# Altium project OR_TM2Space.PrjPcb
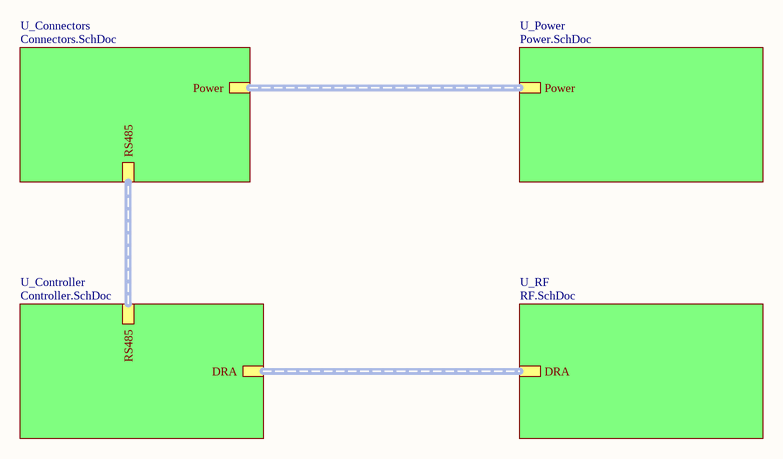
[diagram p0: Legend.SchDoc]
PCBSolderMaskSides: Both Sides; PCBSolderMaskColor: Green; PCBSilkscreenSides: Both Sides; PCBSilkscreenColor: White; PCBMfgStandard: IPC 6012 Class 2; PCBFinishThickness: 63 mils +/- 10%; PCBFinishPlating: LEAD FREE HASL; GlobalRevisionDate: 09/11/2022; GlobalProjectRevision: REV1-0; GlobalProjectName: OR_TM2Space; GlobalProjectCustomer: OR_TM2Space; DONOTPOPULATE: DNP
5 sheets, 103 parts. Net scope: hierarchical (ports join the sheet entries above them; power ports are global).
Board file: OR_TM2Space.PcbDoc
Sheets:
  Legend.SchDoc
    U_Connectors = Connectors.SchDoc
    U_Controller = Controller.SchDoc
    U_Power = Power.SchDoc
    U_RF = RF.SchDoc

## Sheet Legend.SchDoc
size A4; SheetNumber: 1; SheetTotal: 5

### Sub-sheets
U_Connectors = Connectors.SchDoc: RS485, Power
U_Controller = Controller.SchDoc: RS485, DRA
U_Power = Power.SchDoc: Power
U_RF = RF.SchDoc: DRA

### Buses and harness runs
harness sheet U_Connectors/Power = sheet U_Power/Power
harness sheet U_Connectors/RS485 = sheet U_Controller/RS485
harness sheet U_Controller/DRA = sheet U_RF/DRA

## Sheet Connectors.SchDoc
size A4; SheetNumber: 2; SheetTotal: 5
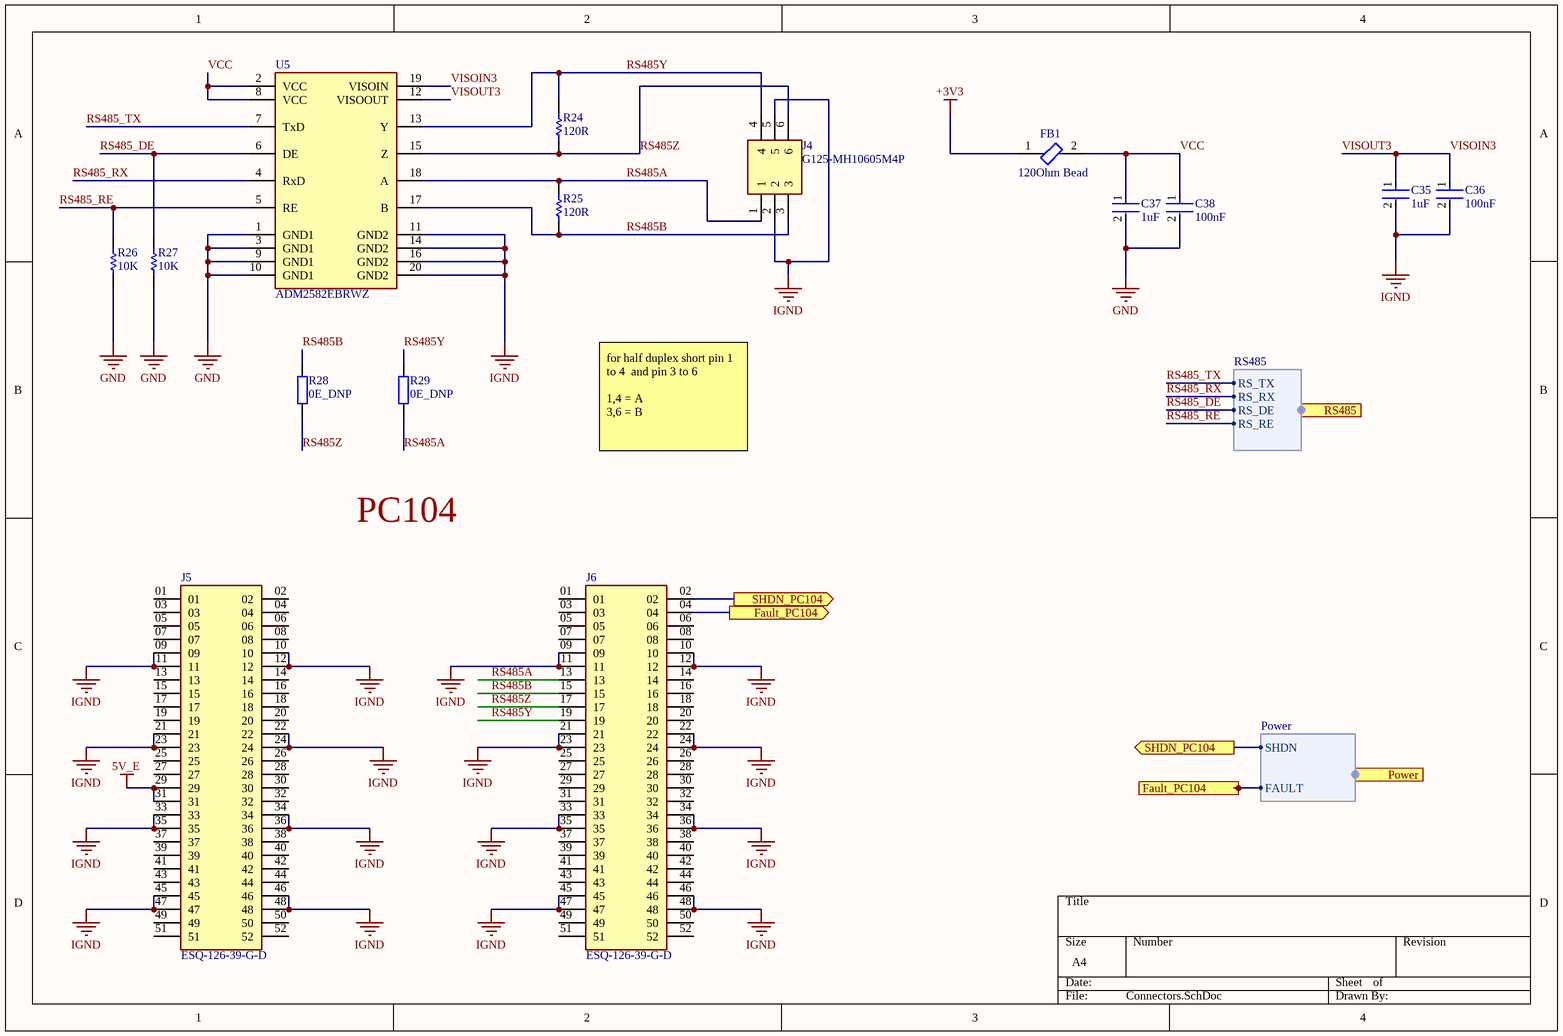
[diagram p1: Connectors.SchDoc]

### Parts
C35  1uF  [CAP0603S]
C36  100nF  [CAP0402S]
C37  1uF  [CAP0603S]
C38  100nF  [CAP0402S]
FB1  120Ohm Bead  [FB0402S]
J4  G125-MH10605M4P  [HARWIN_G125-MH10605M4P]
J5  ESQ-126-39-G-D  [SAMTEC_ESQ-126-39-G-D]
J6  ESQ-126-39-G-D  [SAMTEC_ESQ-126-39-G-D]
R24  120R  [RES0805S]
R25  120R  [RES0805S]
R26  10K  [RES0402S]
R27  10K  [RES0402S]
R28  0E_DNP  [RES0603S]
R29  0E_DNP  [RES0603S]
U5  ADM2582EBRWZ  [SOIC-20]

### Ports
Fault_PC104 (out), Power (harness Power), RS485 (harness RS485), SHDN_PC104 (out)

### Harnesses
RS485: RS_TX, RS_RX, RS_DE, RS_RE
Power: SHDN, FAULT

### Nets
5V_E: J5.29 J5.31
+3V3: FB1.1
GND: C37.2 C38.2 R26.1 R27.1 U5.1(GND1) U5.3(GND1) U5.9(GND1) U5.10(GND1)  [project net VSSA]
IGND: C35.2 C36.2 J4.2 J4.5 J5.09 J5.10 J5.11 J5.12 J5.21 J5.22 J5.23 J5.24 J5.33 J5.34 J5.35 J5.36 J5.45 J5.46 J5.47 J5.48 J6.09 J6.10 J6.11 J6.12 J6.21 J6.22 J6.23 J6.24 J6.33 J6.34 J6.35 J6.36 J6.45 J6.46 J6.47 J6.48 U5.11(GND2) U5.14(GND2) U5.16(GND2) U5.20(GND2)
Fuse_FLT: J6.04 ; port Fault_PC104, port Power.FAULT
Fuse_SNT: J6.02 ; port SHDN_PC104, port Power.SHDN
RS485_DE: R27.2 U5.6(DE) ; port RS485.RS_DE
RS485_RE: R26.2 U5.5(RE) ; port RS485.RS_RE
RS485_RX: U5.4(RxD) ; port RS485.RS_RX
RS485_TX: U5.7(TxD) ; port RS485.RS_TX
RS485A: J4.1 J6.13 R25.2 R29.1 U5.18(A)
RS485B: J4.3 J6.15 R25.1 R28.2 U5.17(B)
RS485Y: J4.4 J6.19 R24.2 R29.2 U5.13(Y)
RS485Z: J4.6 J6.17 R24.1 R28.1 U5.15(Z)
VCC: C37.1 C38.1 FB1.2 U5.2(VCC) U5.8(VCC)
VISOIN3: C35.1 C36.1 U5.12(VISOOUT) U5.19(VISOIN)  [also labelled VISOUT3]

Not connected (* = marked no-connect by the designer): J5 01 02 03 04 05 06 07 08 13 14 15 16 17 18 19 20 25 26 27 28 30 32 37 38 39 40 41 42 43 44 49 50 51 52; J6 01 03 05 06 07 08 14 16 18 20 25 26 27 28 29 30 31 32 37 38 39 40 41 42 43 44 49 50 51 52

### Notes on the sheet
- for half duplex short pin 1 to 4  and pin 3 to 6
  1,4 = A
  3,6 = B
- PC104

### Library data of the parts
C35 C37 = 11868f565c42a9108669ba33697ecf6: Ceramic Capacitor General Use 1uF ±10% 50V X7R 0603; Series: M; Width: 0.031inch; Mount: Surface Mount; Radiation Hardening: No; Voltage Rating (DC): 50V; Packaging: Tape and Reel; Termination: SMD/SMT; Depth: 0.8mm; Case Code (Metric): 1608; Case Code (Imperial): 0603; Height: 0.8mm; Voltage Rating: 50V; Package Quantity: 1; Halogen Free: Halogen Free; Dielectric: X7R; Min Operating Temperature: -55°C; Length: 1.6mm; Construction: Flat; Tolerance: 10%; Thickness: 0.037inch; Max Operating Temperature: 125°C; Case/Package: 0603; Capacitance: 1uF; RoHS Compliant: Yes
C36 C38 = b4654b650e69147ec39a6b967a45e02: CAP CER 0.1UF 10V X5R 0402; Manufacturer: Kemet; Manufacturer Part Number: C0402C104K8PACTU; Material: Ceramic; Capacitance: 0.10 μF; Temperature Coefficient: 15%; Tolerance: 0.1; Value: 0.10 μF; Package: C0402-BB; Temperature: -55°C to +125°C; ComponentLink2Description: Datasheet; Temperature Characteristic: X5R; Device Class L1: Passive Components; Height: 0.55mm; Lead Free: Yes; ComponentLink2URL: https://content.kemet.com/datasheets/KEM_C1002_X7R_SMD.pdf; Device Class L2: Capacitors; Temperature Range Low: -55°C; Temperature Range High: +125°C; RoHS: TRUE; Octopart: https://octopart.com/c0402c104k8pactu-kemet-140039; Automotive: No; Mouser Description: Capacitor 100 nF 10 VDC 0402; Category: Cap; Voltage Rating: 10 V; Digikey Description: CAP CER 0.1UF 10V X5R 0402; Ipc Land Pattern Name: CAPC10050X50; Device Class L3: Ceramic Capacitors
FB1 = 5f30dd21d616792df468990f7003faa: FERRITE BEAD 120 OHM 0805 1LN; Number of Lines: 1; DC Resistance-Max: 100mR; Material: Steel; Max DC Current: 200mA; Shielding: Unshielded; Test Frequency: 100MHz; Impedance: 120R; Current Rating: 800mA; Max Current Rating: 1A; Resistance: 150mR; Tolerance: 25%; Width: 1.25mm; Number of Circuits: 1; Military Standard: Not; Height: 0.85mm; Series: BLM21A; Min Operating Temperature: -55°C; DC Resistance (DCR): 100mR; Termination: SMD/SMT; Core Material: Ferrite; REACH SVHC: No SVHC; Radiation Hardening: No; Max Operating Temperature: 125°C; Number of Pins: 2; Case/Package: 0805; Case Code (Imperial): 0805; Frequency: 100MHz; Depth: 1.25mm; Length: 2mm; DC Current: 200mA; Lead Free: Lead Free; Case Code (Metric): 2012; Package Quantity: 1; Packaging: Tape and Reel
J4 = G125-MH10605M4P: Connector; Manufacturer_Name: Harwin; Datasheet Link: https://content.harwin.com/m/667f1be9427fb768/original/DRG-02921-Technical-Drawing-Datasheet-G125-MH1XX05M4P-pdf.pdf; Height: 5.25mm; Manufacturer_Part_Number: G125-MH10605M4P; Mouser Part Number: 855-G125MH1065M4PM4P; Mouser Price/Stock: https://www.mouser.co.uk/ProductDetail/Harwin/G125-MH10605M4P?qs=vHuUswq2%252BswF07IXFR1W6A%3D%3D
J5 J6 = ESQ-126-39-G-D: 52 Position Elevated Socket Connector Through Hole; MF: Samtec; Package: None; MP: ESQ-126-39-G-D; Value: *; Availability: Unavailable; Price: None; SnapEDA_Link: https://www.snapeda.com/parts/ESQ-126-39-G-D/Samtec%20Inc./view-part/490181/?ref=snap
R24 R25 = RES-2: Chip Resistor, 120 Ohm, +/- 1%, 0.125 W, -55 to 155 degC, 0805 (2012 Metric), RoHS, Tape and Reel; Manufacturer: Panasonic; Voltage Rating: 150 V; Mount: Surface Mount; ComponentLink1Description: Manufacturer URL; ComponentLink1URL: http://www.panasonic.com/; RoHSCompliant: true; Min Operating Temperature: -55 degC; Length: 2 mm; Max Operating Temperature: 155 degC; Packaging: Tape and Reel; Package Quantity: 5000; REACH SVHC: Yes; Pins: 2; ComponentLink2Description: Datasheet; DatasheetVersion: 04/2015; PackageReference: 0805; ComponentLink2URL: http://industrial.panasonic.com/cdbs/www-data/pdf/RDA0000/AOA0000C86.pdf; Mounting Technology: Surface Mount; PackageDescription: 2-Pin Surface Mount Device, Body 2 x 1.25 mm; Height: 0.6 mm
R26 R27 = RES-2: Chip Resistor, 10 KOhm, +/- 1%, 0.1 W, -55 to 155 degC, 0402 (1005 Metric), RoHS, Tape and Reel; Manufacturer: Panasonic; Power Rating: 100mW; Voltage Rating: 50V; Resistance: 10KOhm; Case\/Package: 0402; Temperature Coefficient: 100ppm\/degreesC; RoHSCompliant: True; Lead Free: LeadFree; Package Quantity: 1; Contact Plating: Tin; Length: 1mm; Radiation Hardening: No; REACH SVHC: NoSVHC; Max Operating Temperature: 155degC; Depth: 0.5mm; Case Code (Imperial): 0402; Military Standard: Not; Package Description: 2-Pin Surface Mount Device, Body 1 x 0.5 mm; Termination: SMD/SMT; Case Code (Metric): 1005; Height: 0.35mm; Packaging: TapeandReel; Voltage Rating (DC): 50V; Package Reference: 402; Number of Pins: 2; Tolerance: 1%; Mounting Technology: SurfaceMount; Width: 0.02inch; Mount: SurfaceMount; Datasheet URL: https://industrial.panasonic.com/cdbs/www-data/pdf/RDA0000/AOA0000C304.pdf; Composition: ThickFilm; Datasheet Version: 02/2017; Manufacturer URL: http://www.panasonic.com/; Max Power Dissipation: 100mW; Number of Terminations: 2; Min Operating Temperature: -55degC
R28 R29 = RES_0603: Resistor SMD 0603; Manufacturer: *; Manufacturer Part Number: *; Distributor Link: *; LCSC: *
U5 = ADM2582EBRWZ: Isolated Full Duplex RS485 Transreciver

## Sheet Controller.SchDoc
size A4; SheetNumber: 3; SheetTotal: 5
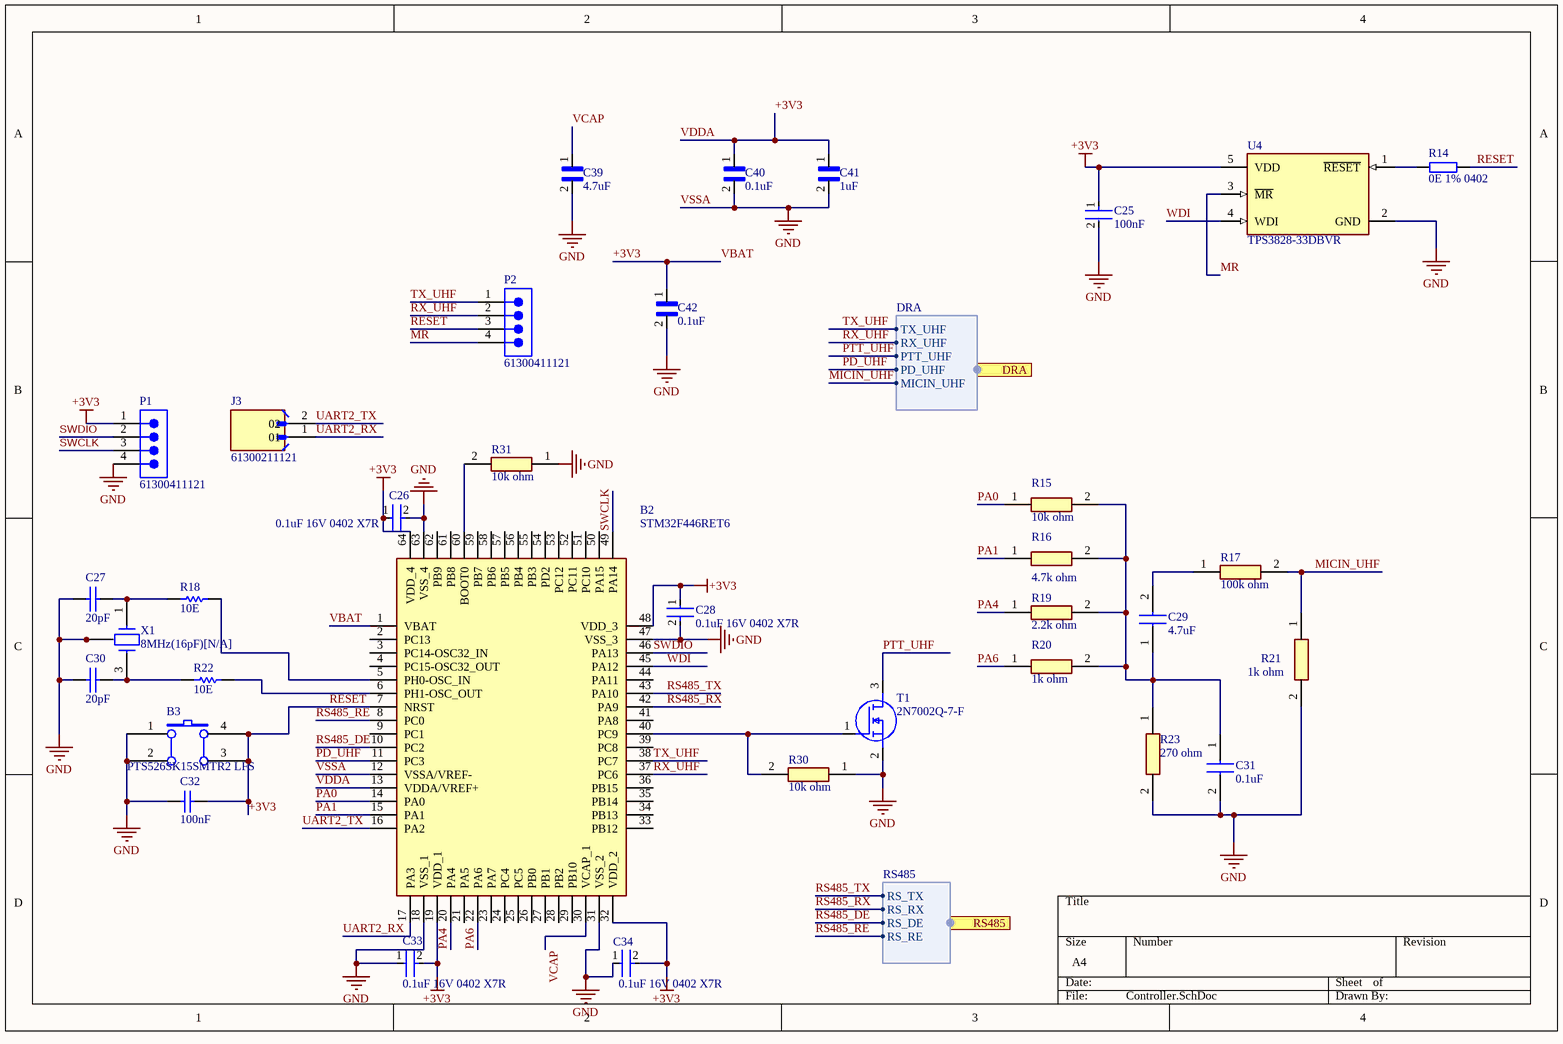
[diagram p2: Controller.SchDoc]

### Parts
B2  STM32F446RET6  [LQFP64]
B3  PTS526SK15SMTR2 LFS  [PTS526SK15SMTR2 LFS]
C25  100nF  [CAP0402S]
C26  0.1uF 16V 0402 X7R  [CAP0402S]
C27  20pF  [C0201]
C28  0.1uF 16V 0402 X7R  [CAP0402S]
C29  4.7uF  [CAP0603S]
C30  20pF  [C0201]
C31  0.1uF  [CAP0603S]
C32  100nF  [CAP0603S]
C33  0.1uF 16V 0402 X7R  [CAP0402S]
C34  0.1uF 16V 0402 X7R  [CAP0402S]
C39  4.7uF  [CAP0603S]
C40  0.1uF  [CAP0603S]
C41  1uF  [CAP0603S]
C42  0.1uF  [CAP0603S]
J3  61300211121  [HDR_P2.54_2X1_VERTICAL_TH]
P1  61300411121  [HDR_P2.0_4X1_VERTICAL_TH]
P2  61300411121  [HDR_P2.0_4X1_VERTICAL_TH]
R14  0E 1% 0402  [RES0402S]
R15  10k ohm  [RES0603S]
R16  4.7k ohm  [RES0603S]
R17  100k ohm  [RES0603S]
R18  10E  [RES0603S]
R19  2.2k ohm  [RES0603S]
R20  1k ohm  [RES0603S]
R21  1k ohm  [RES0603S]
R22  10E  [RES0603S]
R23  270 ohm  [RES0603S]
R30  10k ohm  [RES0603S]
R31  10k ohm  [RES0603S]
T1  2N7002Q-7-F  [SOT23_3]
U4  TPS3828-33DBVR  [SOT23-5]
X1  8MHz(16pF)[N/A]  [WE-XTAL_CFPX-104]

### Ports
DRA (harness DRA), RS485 (harness RS485)

### Harnesses
RS485: RS_TX, RS_RX, RS_DE, RS_RE
DRA: TX_UHF, RX_UHF, PTT_UHF, PD_UHF, MICIN_UHF

### Nets
+3V3: B2.1(VBAT) B2.7(NRST) B2.13(VDDA/VREF+) B2.19(VDD_1) B2.32(VDD_2) B2.48(VDD_3) B2.64(VDD_4) B3.3(B1) B3.4(A1) C25.1 C26.1 C28.1 C32.1 C33.2 C34.2 C40.1 C41.1 C42.1 P1.1 P2.3 R14.2 U4.5(VDD)  [also labelled RESET, VBAT, VDDA]
VSSA: B2.12(VSSA/VREF-) B2.18(VSS_1) B2.31(VSS_2) B2.47(VSS_3) B2.63(VSS_4) B3.1(A0) B3.2(B0) C25.2 C26.2 C27.2 C28.2 C30.2 C31.2 C32.2 C33.1 C34.1 C39.2 C40.2 C41.2 C42.2 P1.4 R21.2 R23.2 R30.1 R31.1 T1.2(S) U4.2(GND) X1.2 X1.4  [also labelled GND]
MICIN_UHF: R17.2 R21.1 ; port DRA.MICIN_UHF
MR: P2.4 U4.3(~{MR})
PA0: B2.14(PA0) R15.1
PA1: B2.15(PA1) R16.1
PA4: B2.20(PA4) R19.1
PA6: B2.22(PA6) R20.1
PD_UHF: B2.11(PC3) ; port DRA.PD_UHF
PTT_UHF: T1.3(D) ; port DRA.PTT_UHF
RS485_DE: B2.10(PC2) ; port RS485.RS_DE
RS485_RE: B2.8(PC0) ; port RS485.RS_RE
RS485_RX: B2.42(PA9) ; port RS485.RS_RX
RS485_TX: B2.43(PA10) ; port RS485.RS_TX
RX_UHF: B2.37(PC6) P2.2 ; port DRA.RX_UHF
SWCLK: B2.49(PA14) P1.3
SWDIO: B2.46(PA13) P1.2
TX_UHF: B2.38(PC7) P2.1 ; port DRA.TX_UHF
UART2_RX: B2.17(PA3) J3.1(01)
UART2_TX: B2.16(PA2) J3.2(02)
VCAP: B2.30(VCAP_1) C39.1
WDI: B2.45(PA12) U4.4(WDI)
NetB2_5: B2.5(PH0-OSC_IN) R18.1
NetB2_6: B2.6(PH1-OSC_OUT) R22.1
NetB2_40: B2.40(PC9) R30.2 T1.1(G)
NetB2_60: B2.60(BOOT0) R31.2
NetC27_1: C27.1 R18.2 X1.1
NetC29_1: C29.1 C31.1 R15.2 R16.2 R19.2 R20.2 R23.1
NetC29_2: C29.2 R17.1
NetC30_1: C30.1 R22.2 X1.3
NetR14_1: R14.1 U4.1(~{RESET})

Not connected (* = marked no-connect by the designer): B2 2(PC13) 3(PC14-OSC32_IN) 4(PC15-OSC32_OUT) 9(PC1) 21(PA5) 23(PA7) 24(PC4) 25(PC5) 26(PB0) 27(PB1) 28(PB2) 29(PB10) 33(PB12) 34(PB13) 35(PB14) 36(PB15) 39(PC8) 41(PA8) 44(PA11) 50(PA15) 51(PC10) 52(PC11) 53(PC12) 54(PD2) 55(PB3) 56(PB4) 57(PB5) 58(PB6) 59(PB7) 61(PB8) 62(PB9)

### Library data of the parts
B2 = STM32F446RET6: 32-Bit MCU+DSP 512K Flash 180MHz LQFP64 STMicroelectronics STM32F446RET6, 32bit ARM Cortex M4 MCU, 180MHz, 512 kB Flash, 64-Pin LQFP; Geometry.Height: 1.6mm; Mouser Part Number: 511-STM32F446RET6; Mouser Price/Stock: https://www.mouser.co.uk/ProductDetail/STMicroelectronics/STM32F446RET6?qs=Ok1pvOkw6%2FqpQsWf8F4wtQ%3D%3D; Manufacturer_Name: STMicroelectronics; Manufacturer_Part_Number: STM32F446RET6; Datasheet Link: https://datasheet.datasheetarchive.com/originals/distributors/DKDS41/DSANUWW0028583.pdf
B3 = SW PUSHBUTTON: SE PUSHBUTTON
C25 = b4654b650e69147ec39a6b967a45e02: as C36 on sheet Connectors; Package: C0402-BB; Temperature: -55°C to +125°C; ComponentLink2Description: Datasheet; Temperature Characteristic: X5R; Device Class L1: Passive Components; Height: 0.55mm; Lead Free: Yes; ComponentLink2URL: https://content.kemet.com/datasheets/KEM_C1002_X7R_SMD.pdf; Device Class L2: Capacitors; Temperature Range Low: -55°C; Temperature Range High: +125°C; RoHS: TRUE; Octopart: https://octopart.com/c0402c104k8pactu-kemet-140039; Automotive: No; Mouser Description: Capacitor 100 nF 10 VDC 0402; Category: Cap; Voltage Rating: 10 V; Digikey Description: CAP CER 0.1UF 10V X5R 0402; Ipc Land Pattern Name: CAPC10050X50; Device Class L3: Ceramic Capacitors
C26 C28 C33 C34 = 236180d848d6139a670b325ea6854c9: CAP CER 0.1UF 16V X7R 0402; Manufacturer Part Number: GRM155R71C104KA88D; Manufacturer: Murata; Standoff Height: 0mm; Tolerance: 10%; Voltage Rating: 16Vdc; Material: Ceramic; Capacitance: 0.10μF; Value: 0.10μF; RoHS: TRUE; Temperature Characteristic: X7R; Octopart: https://octopart.com/grm155r71c104ka88d-murata-196880; Digikey Description: CAP CER 0.1UF 16V X7R 0402; Device Class L3: Ceramic Capacitors; Height: 0.55mm; ComponentLink2Description: Datasheet; Temperature Range Low: -55°C; Ipc Land Pattern Name: CAPC10050X219; ComponentLink2URL: https://search.murata.co.jp/Ceramy/image/img/A01X/G101/ENG/GRM155R71H471KA01-01A.pdf; Device Class L1: Passive Components; Lead Free: yes; Category: Cap; Package: GRM15; Temperature: -55°C to +125°C; Device Class L2: Capacitors; Temperature Range High: +125°C; Mouser Description: 0402 0.1 uF 16V ±10 % Tolerance X7R SMT Multilayer Ceramic Capacitor
C27 C30 = CAP: Capacitor
C29 = GRM188R61E475KE11D: Capacitor; Manufacturer_Name: Murata Electronics; Datasheet Link: https://psearch.en.murata.com/capacitor/product/GRM188R61E475KE11%23.html; Height: 0.9mm; Manufacturer_Part_Number: GRM188R61E475KE11D; Mouser Part Number: 81-GRM188R61E475KE1D; Mouser Price/Stock: https://www.mouser.co.uk/ProductDetail/Murata-Electronics/GRM188R61E475KE11D?qs=eeBpzGFlv%252B9M0HqzMo%2FgYw%3D%3D; Arrow Part Number: GRM188R61E475KE11D; Arrow Price/Stock: https://www.arrow.com/en/products/grm188r61e475ke11d/murata-manufacturing?region=nac
C31 = C0603C104J5RACAUTO: Capacitor; Manufacturer_Name: KEMET; Datasheet Link: https://content.kemet.com/datasheets/KEM_C1023_X7R_AUTO_SMD.pdf; Height: 0.87mm; Manufacturer_Part_Number: C0603C104J5RACAUTO; Mouser Part Number: 80-C0603C104J5RAUTO; Mouser Price/Stock: https://www.mouser.co.uk/ProductDetail/KEMET/C0603C104J5RACAUTO?qs=XYJIsZbdjSO3ULwa1DwJaA%3D%3D; Arrow Part Number: C0603C104J5RACAUTO; Arrow Price/Stock: https://www.arrow.com/en/products/c0603c104j5racauto/kemet-corporation?region=europe
C32 = CAP: Capacitor; Value: 100pF; Published: 8-Jun-2000; Revision: July-2002: Re-released for DXP Platform.; Publisher: Altium Limited
C39-C42 = C0603C101J5GACTU: 100pF Â±5% 50V Ceramic Capacitor C0G, NP0 0603 _1608 Metric_; MF: KEMET; MP: C0603C101J5GACTU; SnapEDA_Link: https://www.snapeda.com/parts/C0603C101J5GACTU/KEMET/view-part/281849/?ref=snap; Availability: Unavailable; Package: 0603 Kemet; Value: *; Price: None
J3 = 61300211121: 2 pins, 1 row, straight, gold plating; MF: Wurth Electronics; SnapEDA_Link: https://www.snapeda.com/parts/61300211121/Wurth+Electronics/view-part/?ref=snap; Package: None; Value: *; MP: 61300211121; Check_prices: https://www.snapeda.com/parts/61300211121/Wurth+Electronics/view-part/?ref=eda
P1 P2 = CMP-1502-01064-3: NexarPartId: 32855522; Operating Supply Voltage: 250V; Pitch: 2.54mm; Contact Resistance: 20mΩ; Number of Positions: 4; Current Rating: 3A; Connector Type: Male Pin; Gender: Male; Contact Plating: Gold; Height: 8.89mm; Lead Pitch: 2.54mm; Lead Free: Lead Free; Contact Mating Length: 5.9944mm; Number of Rows: 1; Termination: Solder; Packaging: Bulk; REACH SVHC: Unknown; Min Operating Temperature: -40°C; RoHS: Compliant; Number of Contacts: 4; Voltage Rating: 250V; Color: Black; Max Operating Temperature: 105°C; Contact Material: Copper; Mount: Through Hole; Orientation: Vertical; Number of Pins: 4
R14 = RES_0402: Resistor SMD 0402; Manufacturer: *; Manufacturer Part Number: *; Distributor Link: *; LCSC: *
R15 R30 R31 = CRCW060310K0FKEA: Resistor; Manufacturer_Name: Vishay; Datasheet Link: http://www.vishay.com/docs/20035/dcrcwe3.pdf; Height: 0.5mm; Manufacturer_Part_Number: CRCW060310K0FKEA; Mouser Part Number: 71-CRCW0603-10K-E3; Mouser Price/Stock: https://www.mouser.co.uk/ProductDetail/Vishay-Dale/CRCW060310K0FKEA?qs=pAO1Z172M84BVnhDjtnsoQ%3D%3D; Arrow Part Number: CRCW060310K0FKEA; Arrow Price/Stock: https://www.arrow.com/en/products/crcw060310k0fkea/vishay?region=europe
R16 = CRCW06034K70FKEA: Resistor; Manufacturer_Name: Vishay; Datasheet Link: http://www.vishay.com/docs/20035/dcrcwe3.pdf; Height: 0.5mm; Manufacturer_Part_Number: CRCW06034K70FKEA; Mouser Part Number: 71-CRCW0603-4.7K-E3; Mouser Price/Stock: https://www.mouser.co.uk/ProductDetail/Vishay-Dale/CRCW06034K70FKEA?qs=4E3O%252BEEZcdLDG%2FSk4GmlWQ%3D%3D; Arrow Part Number: CRCW06034K70FKEA; Arrow Price/Stock: https://www.arrow.com/en/products/crcw06034k70fkea/vishay?region=nac
R17 = CRCW0603100KFKEA: Resistor; Manufacturer_Name: Vishay; Datasheet Link: http://www.vishay.com/docs/20035/dcrcwe3.pdf; Height: 0.5mm; Manufacturer_Part_Number: CRCW0603100KFKEA; Mouser Part Number: 71-CRCW0603-100K-E3; Mouser Price/Stock: https://www.mouser.co.uk/ProductDetail/Vishay-Dale/CRCW0603100KFKEA?qs=6dqgS%252BKntICWHMMdIzt5%2FQ%3D%3D; Arrow Part Number: CRCW0603100KFKEA; Arrow Price/Stock: https://www.arrow.com/en/products/crcw0603100kfkea/vishay?region=nac
R18 R22 = Res1: Resistor; Value: 1K; Published: 8-Jun-2000; Revision: July-2002: Re-released for DXP Platform.; Publisher: Altium Limited
R19 = CRCW06032K20JNEAHP: Resistor; Manufacturer_Name: Vishay; Datasheet Link: http://www.vishay.com/docs/20043/crcwhpe3.pdf; Height: 0.55mm; Manufacturer_Part_Number: CRCW06032K20JNEAHP; Mouser Part Number: 71-CRCW06032K20JNEAH; Mouser Price/Stock: https://www.mouser.co.uk/ProductDetail/Vishay-Dale/CRCW06032K20JNEAHP/?qs=k2%2FDWSARqgFWsVO90R5J%2FQ%3D%3D; Arrow Part Number: CRCW06032K20JNEAHP; Arrow Price/Stock: https://www.arrow.com/en/products/crcw06032k20jneahp/vishay
R20 R21 = CRCW06031K00FKEAHP: Resistor; Manufacturer_Name: Vishay; Datasheet Link: https://componentsearchengine.com/Datasheets/2/CRCW06031K00FKEAHP.pdf; Height: 0.55mm; Manufacturer_Part_Number: CRCW06031K00FKEAHP; Mouser Part Number: 71-CRCW06031K00FKEAH; Mouser Price/Stock: https://www.mouser.co.uk/ProductDetail/Vishay-Dale/CRCW06031K00FKEAHP?qs=FlFvgi4rxBx1%252B5DAse78lQ%3D%3D; Arrow Part Number: CRCW06031K00FKEAHP; Arrow Price/Stock: https://www.arrow.com/en/products/crcw06031k00fkeahp/vishay?region=nac
R23 = CRCW0603270RFKEA: Resistor; Manufacturer_Name: Vishay; Datasheet Link: http://www.vishay.com/docs/20035/dcrcwe3.pdf; Height: 0.5mm; Manufacturer_Part_Number: CRCW0603270RFKEA; Mouser Part Number: 71-CRCW0603-270-E3; Mouser Price/Stock: https://www.mouser.co.uk/ProductDetail/Vishay-Dale/CRCW0603270RFKEA?qs=pbofycSuseMg1CwiubILXA%3D%3D; Arrow Part Number: CRCW0603270RFKEA; Arrow Price/Stock: https://www.arrow.com/en/products/crcw0603270rfkea/vishay
T1 = 2N7000-G: MOSFET (N-Channel); Manufacturer_Name: Microchip; Datasheet Link: http://www.microchip.com/mymicrochip/filehandler.aspx?ddocname=en571380; Height: 5.334mm; Manufacturer_Part_Number: 2N7000-G; Mouser Part Number: 689-2N7000-G; Mouser Price/Stock: https://www.mouser.co.uk/ProductDetail/Microchip-Technology/2N7000-G?qs=yU2N9dt%252BrfnyR%2FOhNomgZw%3D%3D; Arrow Part Number: 2N7000-G; Arrow Price/Stock: https://www.arrow.com/en/products/2n7000-g/microchip-technology?region=nac
U4 = 340a9547a0ab8213f3a8fa70aee32e0: IC 2.93V SUPPLY MONITOR SOT23-5; Manufacturer Part Number: TPS3828-33DBVT; Manufacturer: Texas Instruments; Min Supply Voltage: 1.1V; Number Of Rails Monitored: 1; Max Supply Voltage: 5.5V; Reset Type: Active Low; Watchdog Timer: true; Nominal Supply Current: 15uA; Standoff Height: 0mm; Device Class L1: Integrated Circuits (ICs); Threshold Voltage: 2.93V; Ambient Temperature Range Low: -40°C; Temperature: -40°C to +85°C; Octopart: https://octopart.com/tps3828-33dbvt-texas+instruments-505920; Device Class L2: Power Management ICs; Lead Free: Yes; Height: 1.45mm; Mouser Description: Supervisory Circuits 2.93V Monitor; Automotive: No; ComponentLink2URL: http://www.ti.com/lit/ds/symlink/tps3828.pdf; Ambient Temperature Range High: +85°C; Digikey Description: IC 2.93V SUPPLY MONITOR SOT23-5; ComponentLink2Description: Datasheet; Category: IC; Package: DBV0005A; Temperature Range Low: -40°C; Device Class L3: Voltage Supervisors; Number Of Outputs: 1; RoHS: TRUE; Temperature Range High: +85°C
X1 = CRYSTAL

## Sheet Power.SchDoc
size A3; SheetNumber: 5; SheetTotal: 5
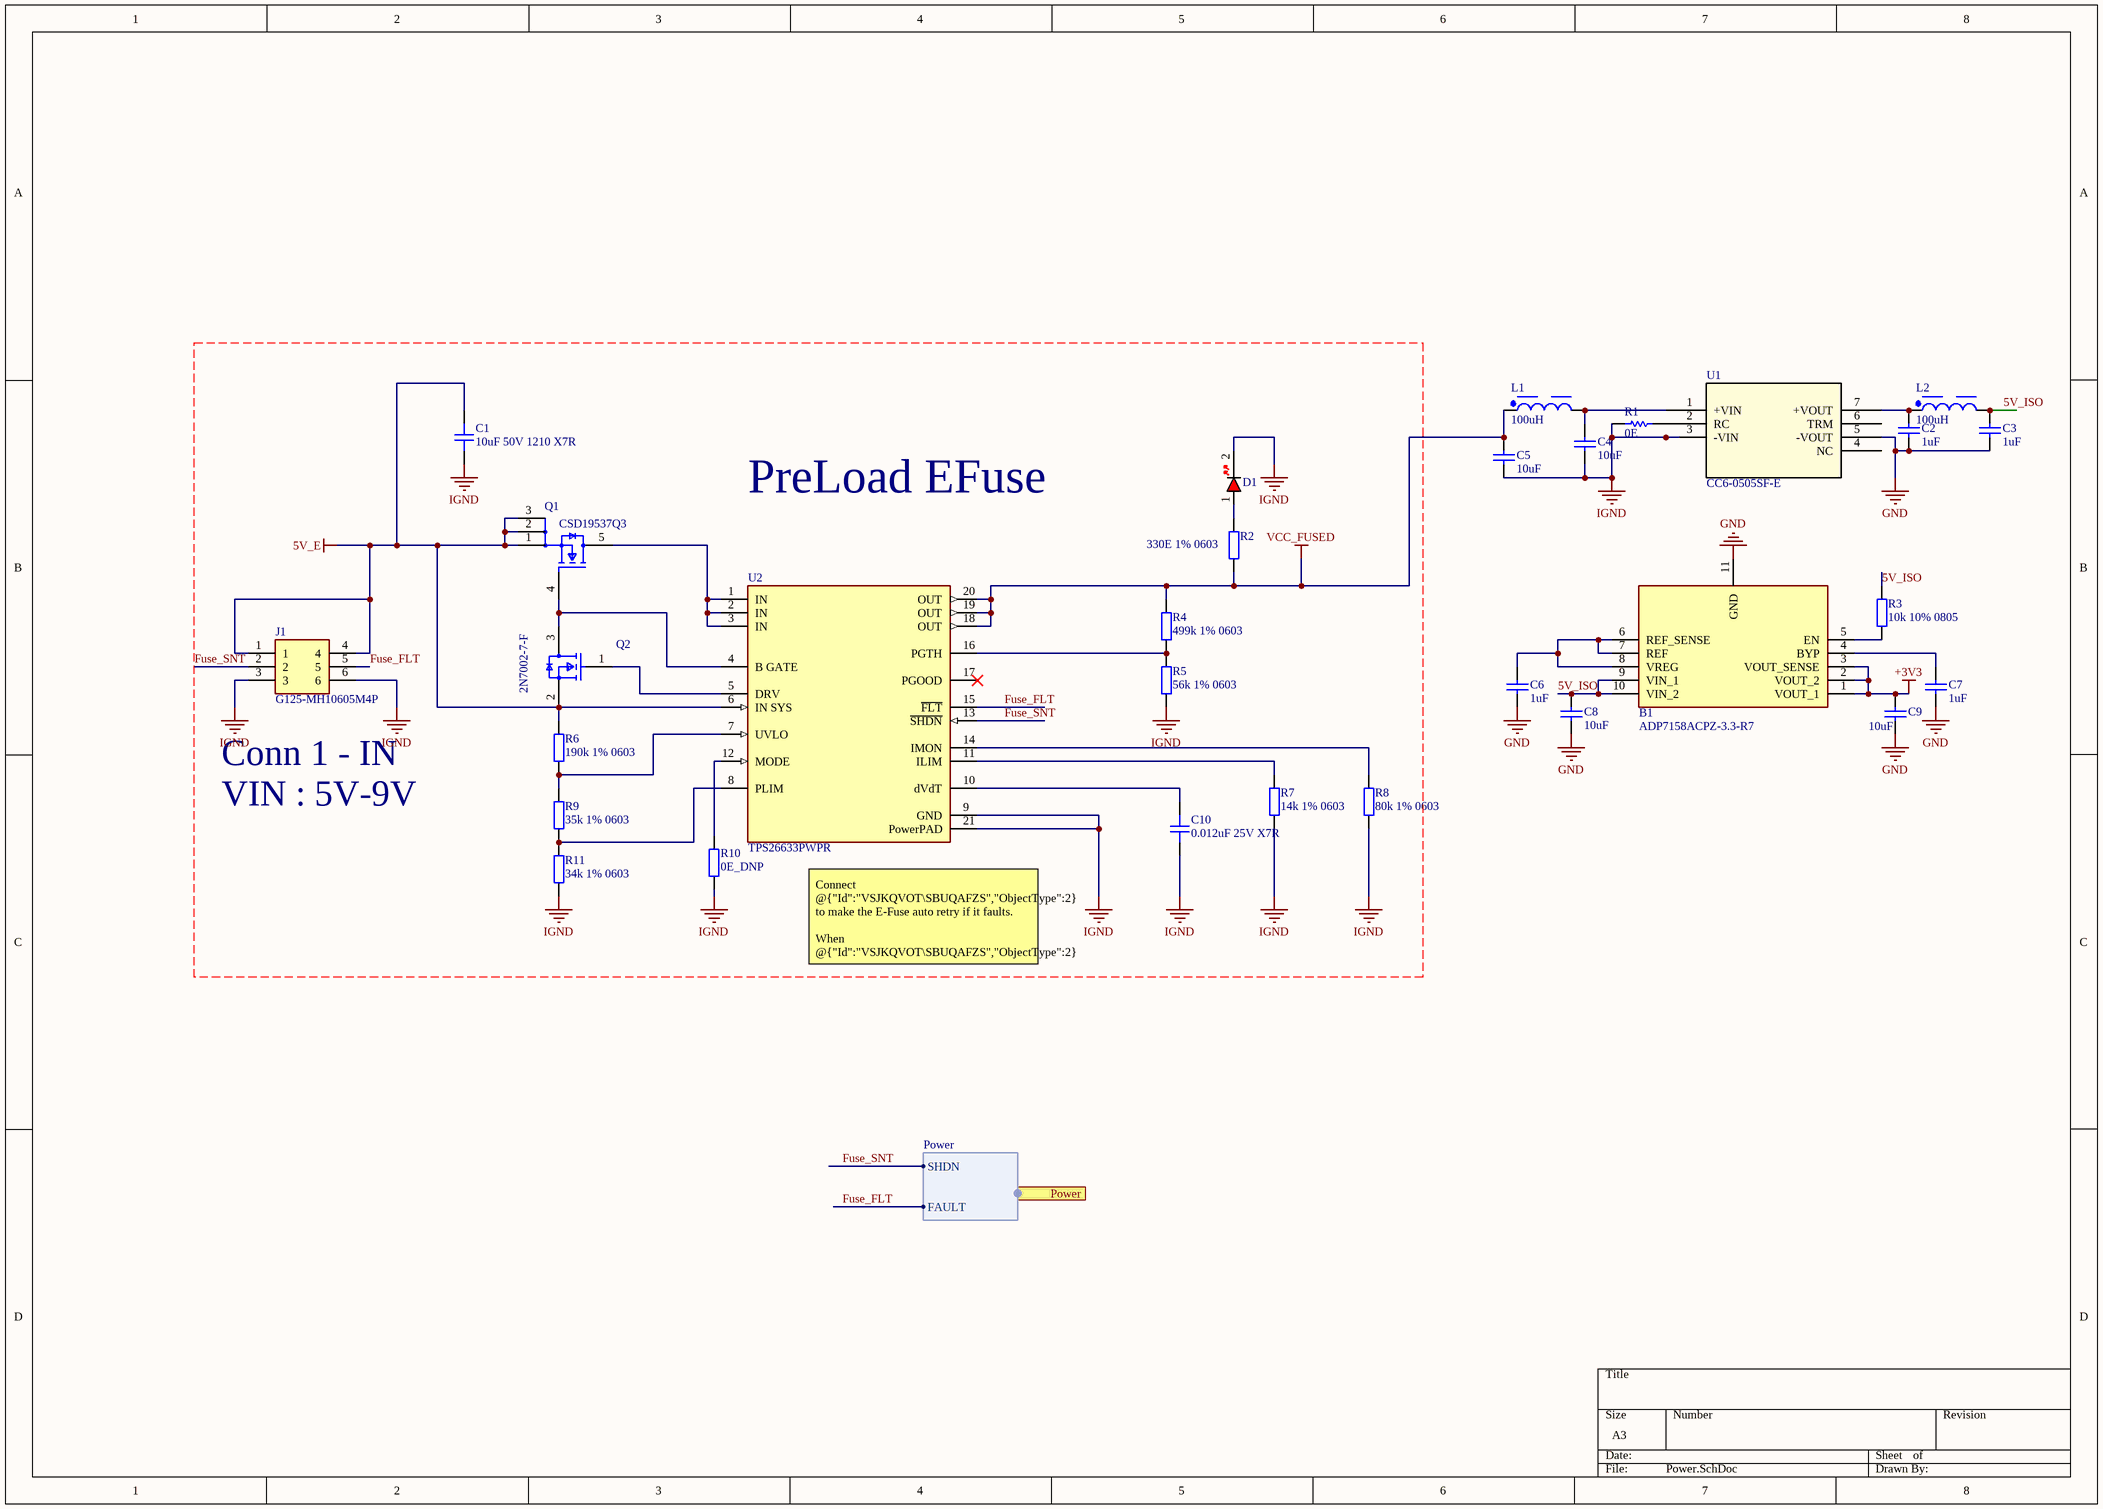
[diagram p3: Power.SchDoc]

### Parts
B1  ADP7158ACPZ-3.3-R7  [LFCSP -10]
C1  10uF 50V 1210 X7R  [CAP1210S]
C2  1uF  [CAP0603S]
C3  1uF  [CAP0603S]
C4  10uF  [CAP0603S]
C5  10uF  [CAP0603S]
C6  1uF  [CAP0603S]
C7  1uF  [CAP0603S]
C8  10uF  [CAP0603S]
C9  10uF  [CAP0603S]
C10  0.012uF 25V X7R  [CAP0805S]
D1  RED  [LED 0603_RED]  (value not drawn)
J1  G125-MH10605M4P  [HARWIN_G125-MH10605M4P]
L1  100uH  [IND_SEMI_SHIELD_6.0X6.0_H4.5_SMD]
L2  100uH  [IND_SEMI_SHIELD_6.0X6.0_H4.5_SMD]
Q1  CSD19537Q3  [TRANS_CSD19537Q3]
Q2  2N7002-7-F  [SOT23_3]
R1  0E  [RES0402S]
R2  330E 1% 0603  [RES0603S]
R3  10k 10% 0805  [RES0805S]
R4  499k 1% 0603  [RES0603S]
R5  56k 1% 0603  [RES0603S]
R6  190k 1% 0603  [RES0603S]
R7  14k 1% 0603  [RES0603S]
R8  80k 1% 0603  [RES0402S]
R9  35k 1% 0603  [RES0603S]
R10  0E_DNP  [RES0603S]
R11  34k 1% 0603  [RES0603S]
U1  CC6-0505SF-E  [CONV_CC6-0505SF-E]
U2  TPS26633PWPR  [SOP65P640X110-21N]

### Ports
Power (harness Power)

### Harnesses
Power: SHDN, FAULT

### Nets
5V_E: C1.2 J1.1 J1.4 Q1.1(S) Q1.2(S) Q1.3(S) Q2.2(S) R6.2 U2.6(IN_SYS)
+3V3: B1.1(VOUT_1) B1.2(VOUT_2) B1.3(VOUT_SENSE) C9.1
GND: B1.11(GND) C2.2 C3.2 C6.2 C7.2 C8.2 C9.2 U1.5(-VOUT)  [project net VSSA]
IGND: C1.1 C4.2 C5.2 C10.1 D1.2(K) J1.3 J1.6 R1.1 R5.1 R7.1 R8.1 R10.1 R11.1 U1.3(-VIN) U2.9(GND) U2.21(PowerPAD)
VCC_FUSED: C5.1 L1.1 R2.1 R4.2 U2.18(OUT) U2.19(OUT) U2.20(OUT)
5V_ISO: B1.9(VIN_1) B1.10(VIN_2) C3.1 C8.1 L2.2 R3.1
Fuse_FLT: J1.5 U2.15(~{FLT}) ; port Power.FAULT
Fuse_SNT: J1.2 U2.13(~{SHDN}) ; port Power.SHDN
NetB1_4: B1.4(BYP) C7.1
NetB1_5: B1.5(EN) R3.2
NetB1_6: B1.6(REF_SENSE) B1.7(REF) B1.8(VREG) C6.1
NetC2_1: C2.1 L2.1 U1.7(+VOUT)
NetC4_1: C4.1 L1.2 U1.1(+VIN)
NetC10_2: C10.2 U2.10(dVdT)
NetD1_1: D1.1(A) R2.2
NetQ1_4: Q1.4(G) Q2.3(D) U2.4(B_GATE)
NetQ1_5: Q1.5(D) U2.1(IN) U2.2(IN) U2.3(IN)
NetQ2_1: Q2.1(G) U2.5(DRV)
NetR1_2: R1.2 U1.2(RC)
NetR4_1: R4.1 R5.2 U2.16(PGTH)
NetR6_1: R6.1 R9.2 U2.7(UVLO)
NetR7_2: R7.2 U2.11(ILIM)
NetR8_2: R8.2 U2.14(IMON)
NetR9_1: R9.1 R11.2 U2.8(PLIM)
NetR10_2: R10.2 U2.12(MODE)

Not connected (* = marked no-connect by the designer): U1 4(NC) 6(TRM); U2 17(PGOOD)*

### Notes on the sheet
- PreLoad EFuse
- Conn 1 - IN
- VIN : 5V-9V
- (near U2) Connect @{"Id":"VSJKQVOT\SBUQAFZS","ObjectType":2} to make the E-Fuse auto retry if it faults.
  When @{"Id":"VSJKQVOT\SBUQAFZS","ObjectType":2} is not connected the @{"Id":"VSJKQVOT\QRUFGIOD","ObjectType":1} has to be toggled externally to restart the E-Fuse

### Library data of the parts
B1 = ADP7158ACPZ-3.3-R7: LDO Voltage Regulators 3.3/5Vin 2A Ultra Low Noise LDO Fixed; Manufacturer_Name: Analog Devices; Geometry.Height: 0.85mm; Mouser Part Number: 584-ADP7158ACPZ3.3R7; Mouser Price/Stock: https://www.mouser.co.uk/ProductDetail/Analog-Devices/ADP7158ACPZ-3.3-R7?qs=JeIcUl65ClCPnjVOMj%2F7AA%3D%3D; Manufacturer_Part_Number: ADP7158ACPZ-3.3-R7; Datasheet Link: http://www.analog.com/media/en/technical-documentation/data-sheets/ADP7158.pdf
C1 = CAP_1210: Capacitor SMD 1210; Manufacturer: *; Manufacturer Part Number: *; Distributor Link: *; LCSC: *; Rating: *; Dielectric: *
C2-C9 = CAP: Capacitor; Value: 100pF; Published: 8-Jun-2000; Revision: July-2002: Re-released for DXP Platform.; Publisher: Altium Limited
C10 = CAP_0603: Capacitor SMD 0603; Manufacturer: *; Manufacturer Part Number: *; Distributor Link: *; LCSC: *; Rating: *; Dielectric: *
D1 = LED_0603_RED: LED 0603 RED SMD
J1 = G125-MH10605M4P: Connector; Manufacturer_Name: Harwin; Datasheet Link: https://content.harwin.com/m/667f1be9427fb768/original/DRG-02921-Technical-Drawing-Datasheet-G125-MH1XX05M4P-pdf.pdf; Height: 5.25mm; Manufacturer_Part_Number: G125-MH10605M4P; Mouser Part Number: 855-G125MH1065M4PM4P; Mouser Price/Stock: https://www.mouser.co.uk/ProductDetail/Harwin/G125-MH10605M4P?qs=vHuUswq2%252BswF07IXFR1W6A%3D%3D
L1 L2 = CMP-1396-00036-2: NexarPartId: 22866940; Current Rating: 1.5A; Saturation Current: 1.8A; Self Resonant Frequency: 5.9MHz; Resistance: 198mΩ; Test Frequency: 100kHz; Inductance: 100µH; Inductance Tolerance: 20%; Shielding: Shielded; Core Material: Ferrite; DC Resistance (DCR): 165mΩ; Termination: SMD/SMT; Length: 10mm; Ambient Temperature Range High: 110°C; RMS Current (Irms): 1.5A; Packaging: Digi-Reel®; RoHS: Compliant; Series Resistance: 198mΩ; Ambient Temperature Range Low: -40°C; Case/Package: Nonstandard; Number of Pins: 2; Height: 5mm; Max Operating Temperature: 150°C; Min Operating Temperature: -40°C; REACH SVHC: Unknown; Height - Seated (Max): 5.0038mm; Width: 10mm; Tolerance: 20%; Max DC Current: 1.5A; Composition: Wirewound; Depth: 10mm; Mount: Surface Mount
Q1 = 7382af88e928fdc71488234cfaaf11c: MOSFET N-CH 100V 50A 8VSON; Max Power Dissipation: 2.8W; Turn-On Delay Time: 5ns; Gate to Source Voltage (Vgs): 20V; Input Capacitance: 1.68nF; Rds On Max: 14.5mR; Fall Time: 3ns; Turn-Off Delay Time: 10ns; Continuous Drain Current (ID): 50A; Lead Free: Contains Lead; Mount: Surface Mount; Number of Pins: 8; Min Operating Temperature: -55°C; Packaging: Rail/Tube; Rise Time: 3ns; Contact Plating: Copper; RoHS Compliant: Yes; Drain to Source Voltage (Vdss): 100V; Max Operating Temperature: 150°C
Q2 = 3b9c635fedb024a5347a57b145af9cc: MOSFET N-CH 60V 115MA SOT23-3; Turn-On Delay Time: 7ns; Turn-Off Delay Time: 11ns; Drain to Source Resistance: 7.5R; Rise Time: 3ns; Drain to Source Breakdown Voltage: 70V; Input Capacitance: 50pF; Number of Elements: 1; Power Dissipation: 540mW; Max Power Dissipation: 300mW; Fall Time: 5.6ns; Gate to Source Voltage (Vgs): 20V; Threshold Voltage: 2.5V; Element Configuration: Single; Termination: SMD/SMT; Weight: 0.000282oz; Radiation Hardening: No; Max Operating Temperature: 150°C; On-State Resistance: 7.5R; Mount: Surface Mount; Current Rating: 115mA; Contact Plating: Tin; Lead Free: Lead Free; Min Operating Temperature: -55°C; Number of Pins: 3; REACH SVHC: No SVHC; Drain to Source Voltage (Vdss): 60V; Width: 1.3mm; Package Quantity: 3000; Length: 2.9mm; Case/Package: SOT-23; Number of Channels: 1; Dual Supply Voltage: 60V; Packaging: Tape and Reel; Height: 1mm; Voltage Rating (DC): 60V; Nominal Vgs: 2.5V; Continuous Drain Current (ID): 115mA; Voltage: 60V; Rds On Max: 7.5R
R1 = res1: Resistor; Value: 1K; Published: 8-Jun-2000; Revision: July-2002: Re-released for DXP Platform.; Publisher: Altium Limited
R2 R4-R11 = RES_0603: Resistor SMD 0603; Manufacturer: *; Manufacturer Part Number: *; Distributor Link: *; LCSC: *
R3 = RES_0805: Resistor SMD 0805; Manufacturer: *; Manufacturer Part Number: *; Distributor Link: *; LCSC: *
U1 = CC6-0505SF-E: No Description Available; Mfr_Name: TDK; Type: Power Supplies Board Mount; RefDes: RefDes
U2 = 3aa6c8470eea581a3a5f71473fd1f1f: 4.5V - 60V 6A 29MOHM EFUSE

## Sheet RF.SchDoc
size A4; SheetNumber: 4; SheetTotal: 5
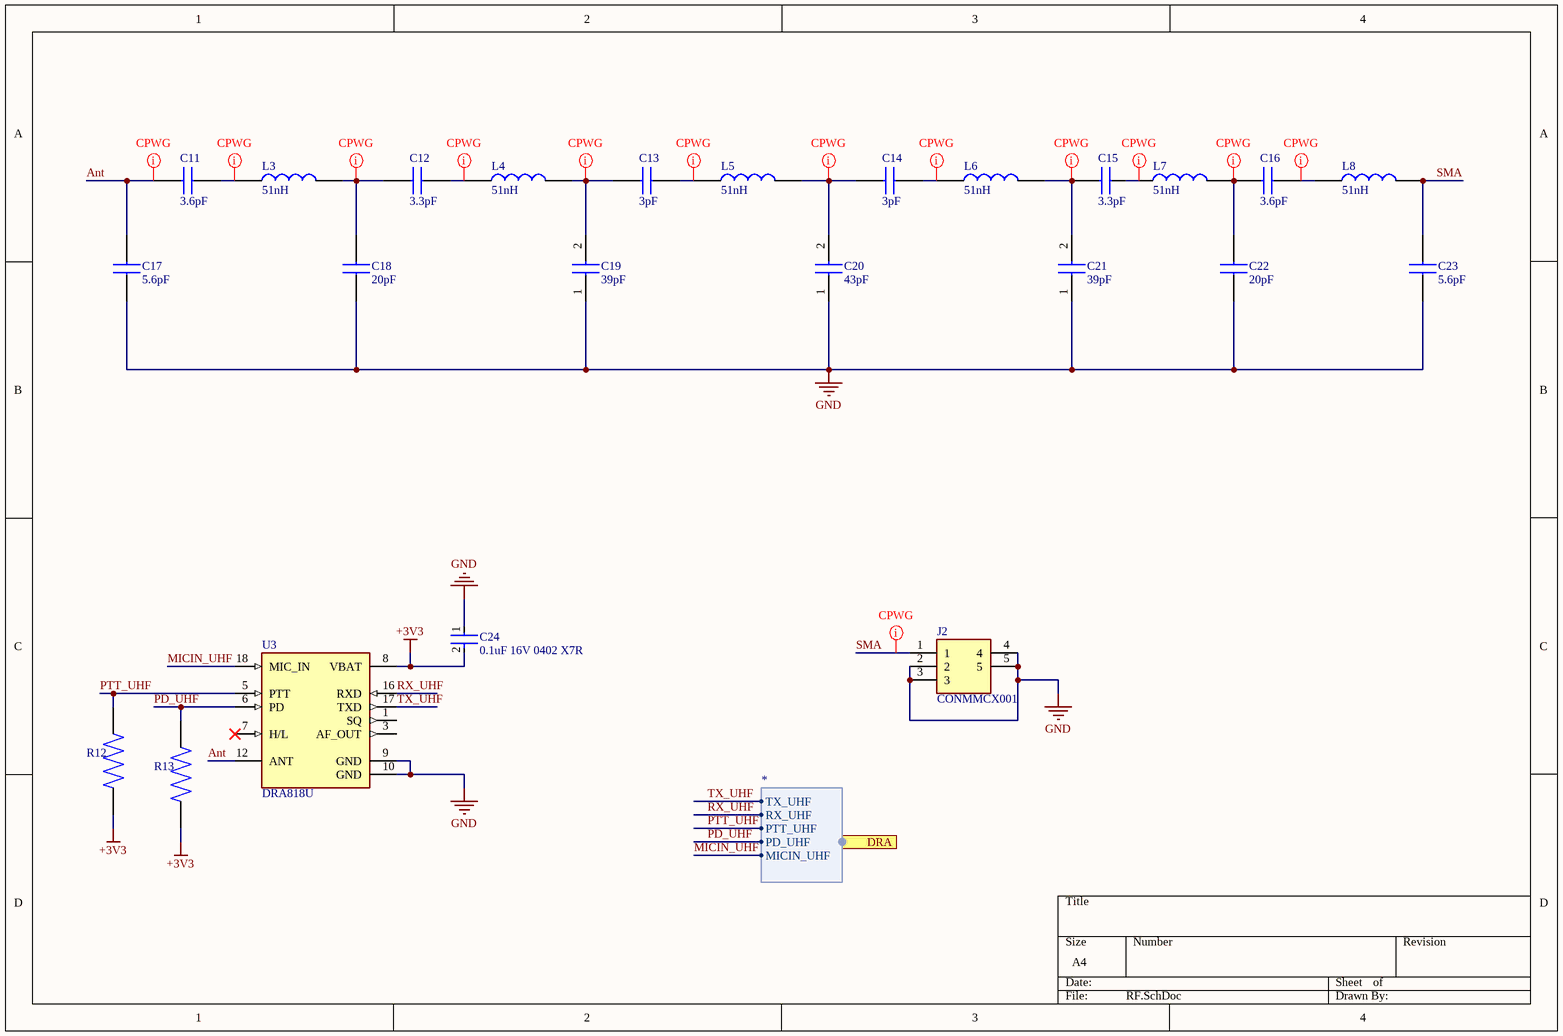
[diagram p4: RF.SchDoc]

### Parts
C11  3.6pF  [CAP0603S]
C12  3.3pF  [CAP0603S]
C13  3pF  [CAP0402S]
C14  3pF  [CAP0402S]
C15  3.3pF  [CAP0603S]
C16  3.6pF  [CAP0603S]
C17  5.6pF  [CAP0603S]
C18  20pF  [CAP0603S]
C19  39pF  [CAP0603S]
C20  43pF  [CAP0603S]
C21  39pF  [CAP0603S]
C22  20pF  [CAP0603S]
C23  5.6pF  [CAP0603S]
C24  0.1uF 16V 0402 X7R  [CAP0402S]
J2  CONMMCX001  [SAMTEC_MMCX-J-P-H-ST-SM1]
L3  51nH  [IND0603S]
L4  51nH  [IND0603S]
L5  51nH  [IND0603S]
L6  51nH  [IND0603S]
L7  51nH  [IND0603S]
L8  51nH  [IND0603S]
R12  CRCW060310K0FKEAC  [RES0603S]  (value not drawn)
R13  CRCW060310K0FKEAC  [RES0603S]  (value not drawn)
U3  DRA818U  [DRA818U]

### Ports
DRA (harness *)

### Harnesses
*: TX_UHF, RX_UHF, PTT_UHF, PD_UHF, MICIN_UHF

### Nets
+3V3: C24.2 R12.1 R13.1 U3.8(VBAT)
GND: C17.1 C18.1 C19.1 C20.1 C21.1 C22.1 C23.1 C24.1 J2.2 J2.3 J2.4 J2.5 U3.9(GND) U3.10(GND)  [project net VSSA]
Ant: C11.1 C17.2 U3.12(ANT)
MICIN_UHF: U3.18(MIC_IN) ; port DRA.MICIN_UHF
PD_UHF: R13.2 U3.6(PD) ; port DRA.PD_UHF
PTT_UHF: R12.2 U3.5(PTT) ; port DRA.PTT_UHF
RX_UHF: U3.16(RXD) ; port DRA.RX_UHF
SMA: C23.2 J2.1 L8.2
TX_UHF: U3.17(TXD) ; port DRA.TX_UHF
NetC11_2: C11.2 L3.1
NetC12_1: C12.1 C18.2 L3.2
NetC12_2: C12.2 L4.1
NetC13_1: C13.1 C19.2 L4.2
NetC13_2: C13.2 L5.1
NetC14_1: C14.1 C20.2 L5.2
NetC14_2: C14.2 L6.1
NetC15_1: C15.1 C21.2 L6.2
NetC15_2: C15.2 L7.1
NetC16_1: C16.1 C22.2 L7.2
NetC16_2: C16.2 L8.1

Not connected (* = marked no-connect by the designer): U3 1(SQ) 3(AF_OUT) 7(H/L)*

### Layout directives
net class CPWG: Ant, NetC11_2, NetC12_1, NetC12_2, NetC13_1, NetC13_2, NetC14_1, NetC14_2, NetC15_1, NetC15_2, NetC16_1, NetC16_2, SMA

### Library data of the parts
C11 C16 = CBR06C369BAGAC: CBR-SMD RF C0G, Ceramic, 3.6 pF, +/-0.1 pF, 250 VDC, 500 VDC, 125C, -55C, C0G, SMD, Fixed, RF, Ultra High Q, Low ESR, Class I, 0.21 % , 10 GOhms, 472, 5.6 mg, 0603, 1.6mm, 0.8mm, 0.8mm, 0.4mm, 4000, 78  Weeks, 120; Manufacturer_Name: KEMET; Geometry.Height: 0.87mm; element14 Part Number: *; element14 Price/Stock: *; Manufacturer_Part_Number: CBR06C369BAGAC; Datasheet Link: http://www.kemet.com/Lists/ProductCatalog/Attachments/490/KEM_C1030_CBR_SMD.pdf
C12 C15 = VJ0603D3R3BXPAJ: Vishay 0603 VJ 3.3pF Ceramic Multilayer Capacitor, 250 V, +125C, COG Dielectric, +/-0.1pF SMD; Geometry.Height: 0.94mm; element14 Part Number: *; element14 Price/Stock: *; Manufacturer_Name: Vishay; Manufacturer_Part_Number: VJ0603D3R3BXPAJ; Datasheet Link: https://g.componentsearchengine.com/Datasheets/2/VJ0603D3R3BXPAJ.pdf
C13 C14 = VJ0603D3R3BXPAJ: QSCF500Q3R0B1GV001T JOHANSON TECHNOLOGY, Capacitor, RF, 3 pF, 50 V, S Series, ± 0.1pF, 150 °C, 0402 [1005 Metric]; Manufacturer_Name: Vishay; Geometry.Height: 0.94mm; element14 Part Number: *; element14 Price/Stock: *; Manufacturer_Part_Number: VJ0603D3R3BXPAJ; Datasheet Link: https://g.componentsearchengine.com/Datasheets/2/VJ0603D3R3BXPAJ.pdf
C17 C23 = 06032U5R6CAT2A: AVX 0603 U 5.6pF Ceramic Multilayer Capacitor, 200 V dc, +125C, C0G Dielectric, +/-0.25pF SMD; Manufacturer_Name: Kyocera AVX; Geometry.Height: 0.9mm; Mouser Part Number: 581-06032U5R6CAT2A; Mouser Price/Stock: https://www.mouser.com/Search/Refine.aspx?Keyword=581-06032U5R6CAT2A; Manufacturer_Part_Number: 06032U5R6CAT2A; Datasheet Link: https://componentsearchengine.com/Datasheets/1/06032U5R6CAT2A.pdf
C18 C22 = CBR02C200F5GAC: CBR-SMD RF C0G, Ceramic, 20 pF, 1%, 50 VDC, 125 VDC, 125C, -55C, C0G, SMD, Fixed, RF, Ultra High Q, Low ESR, Class I, 0.12 % , 10 GOhms, 800, 0.3 mg, 0201, 0.6mm, 0.3mm, 0.3mm, 0.15mm, 15000, 78  Weeks, 120; Manufacturer_Name: KEMET; Geometry.Height: 0.33mm; element14 Part Number: *; element14 Price/Stock: *; Manufacturer_Part_Number: CBR02C200F5GAC; Datasheet Link: http://www.kemet.com/Lists/ProductCatalog/Attachments/490/KEM_C1030_CBR_SMD.pdf
C19 = C0603H390J5GACTU: Capacitor-C0603H390J5GACTU; Manufacturer_Name: KEMET; Datasheet Link: https://content.kemet.com/datasheets/KEM_C1001_C0G_200C_SMD.pdf; Height: 0.87mm; Manufacturer_Part_Number: C0603H390J5GACTU
C20 = CBR06C430J5GACAUTO: Capacitor; Manufacturer_Name: KEMET; Datasheet Link: https://search.kemet.com/download/datasheet/CBR06C430J5GACAUTO; Manufacturer_Part_Number: CBR06C430J5GACAUTO; Mouser Part Number: 80-CBR06C430J5GAUTO; Mouser Price/Stock: https://www.mouser.co.uk/ProductDetail/KEMET/CBR06C430J5GACAUTO?qs=By6Nw2ByBD0kalJAqVwXIA%3D%3D
C21 = C0603H390J5GACTU: Capacitor; Manufacturer_Name: KEMET; Datasheet Link: https://content.kemet.com/datasheets/KEM_C1001_C0G_200C_SMD.pdf; Height: 0.87mm; Manufacturer_Part_Number: C0603H390J5GACTU
C24 = 236180d848d6139a670b325ea6854c9: as C26 on sheet Controller; RoHS: TRUE; Temperature Characteristic: X7R; Octopart: https://octopart.com/grm155r71c104ka88d-murata-196880; Digikey Description: CAP CER 0.1UF 16V X7R 0402; Device Class L3: Ceramic Capacitors; Height: 0.55mm; ComponentLink2Description: Datasheet; Temperature Range Low: -55°C; Ipc Land Pattern Name: CAPC10050X219; ComponentLink2URL: https://search.murata.co.jp/Ceramy/image/img/A01X/G101/ENG/GRM155R71H471KA01-01A.pdf; Device Class L1: Passive Components; Lead Free: yes; Category: Cap; Package: GRM15; Temperature: -55°C to +125°C; Device Class L2: Capacitors; Temperature Range High: +125°C; Mouser Description: 0402 0.1 uF 16V ±10 % Tolerance X7R SMT Multilayer Ceramic Capacitor
J2 = CONMMCX001: Body Features: Cable Connector Orientation Straight; Manufacturer_Name: TE Connectivity; Geometry.Height: 4.7mm; Mouser Part Number: N/A; Mouser Price/Stock: https://www.mouser.co.uk/ProductDetail/TE-Connectivity/CONMMCX001?qs=3Rah4i%252BhyCEhpwEdFc1TTw%3D%3D; Manufacturer_Part_Number: CONMMCX001; Datasheet Link: https://www.te.com/commerce/DocumentDelivery/DDEController?Action=srchrtrv&DocNm=CONMMCX001&DocType=Data%20Sheet&DocLang=English&PartCntxt=CONMMCX001&DocFormat=pdf
L3-L8 = LQW18AN51NG00D: Murata LQQ18A Series Wire-wound SMD Inductor with a Ferrite Core, 0.051 uH +/-2% 370mA Idc Q:38; Manufacturer_Name: Murata Electronics; Geometry.Height: 1mm; Mouser Part Number: 81-LQW18AN51NG00D; Mouser Price/Stock: https://www.mouser.co.uk/ProductDetail/Murata-Electronics/LQW18AN51NG00D?qs=W2MaHu96STYTjVpM0YGYyg%3D%3D; Manufacturer_Part_Number: LQW18AN51NG00D; Datasheet Link: https://search.murata.co.jp/Ceramy/image/img/P02/JELF243A-0024.pdf
R12 R13 = CRCW060310K0FKEAC: 10 kOhms Â±1% 0.1W, 1/10W Chip Resistor 0603 (1608 Metric) Thick Film; MF: Vishay Dale; Availability: Unavailable; SnapEDA_Link: https://www.snapeda.com/parts/CRCW060310K0FKEAC/Vishay%20Dale/view-part/510932/?ref=snap; Price: None; Package: 1608 Rohm Semiconductor; MP: CRCW060310K0FKEAC; Value: *
U3 = DRA818V: UHF Band Voice Transceiver Module; MF: DORJI; Price: None; Check_prices: https://www.snapeda.com/parts/DRA818V/DORJI/view-part/2654524/?ref=eda; SnapEDA_Link: https://www.snapeda.com/parts/DRA818V/DORJI/view-part/2654524/?ref=snap; Package: Package; Availability: Unavailable; MP: DRA818V; Value: *

## Nets that join several sheets
5V_E: Connectors (J5.29 J5.31), Power (9 pins)
+3V3: Connectors (FB1.1), Controller (22 pins), Power (B1.1 B1.2 B1.3 C9.1), RF (C24.2 R12.1 R13.1 U3.8)
IGND: Connectors (40 pins), Power (16 pins)
VSSA: Connectors (8 pins), Controller (29 pins), Power (8 pins), RF (14 pins)
Fuse_FLT: Connectors (J6.04), Power (J1.5 U2.15)
Fuse_SNT: Connectors (J6.02), Power (J1.2 U2.13)
MICIN_UHF: Controller (R17.2 R21.1), RF (U3.18)
PD_UHF: Controller (B2.11), RF (R13.2 U3.6)
PTT_UHF: Controller (T1.3), RF (R12.2 U3.5)
RS485_DE: Connectors (R27.2 U5.6), Controller (B2.10)
RS485_RE: Connectors (R26.2 U5.5), Controller (B2.8)
RS485_RX: Connectors (U5.4), Controller (B2.42)
RS485_TX: Connectors (U5.7), Controller (B2.43)
RX_UHF: Controller (B2.37 P2.2), RF (U3.16)
TX_UHF: Controller (B2.38 P2.1), RF (U3.17)